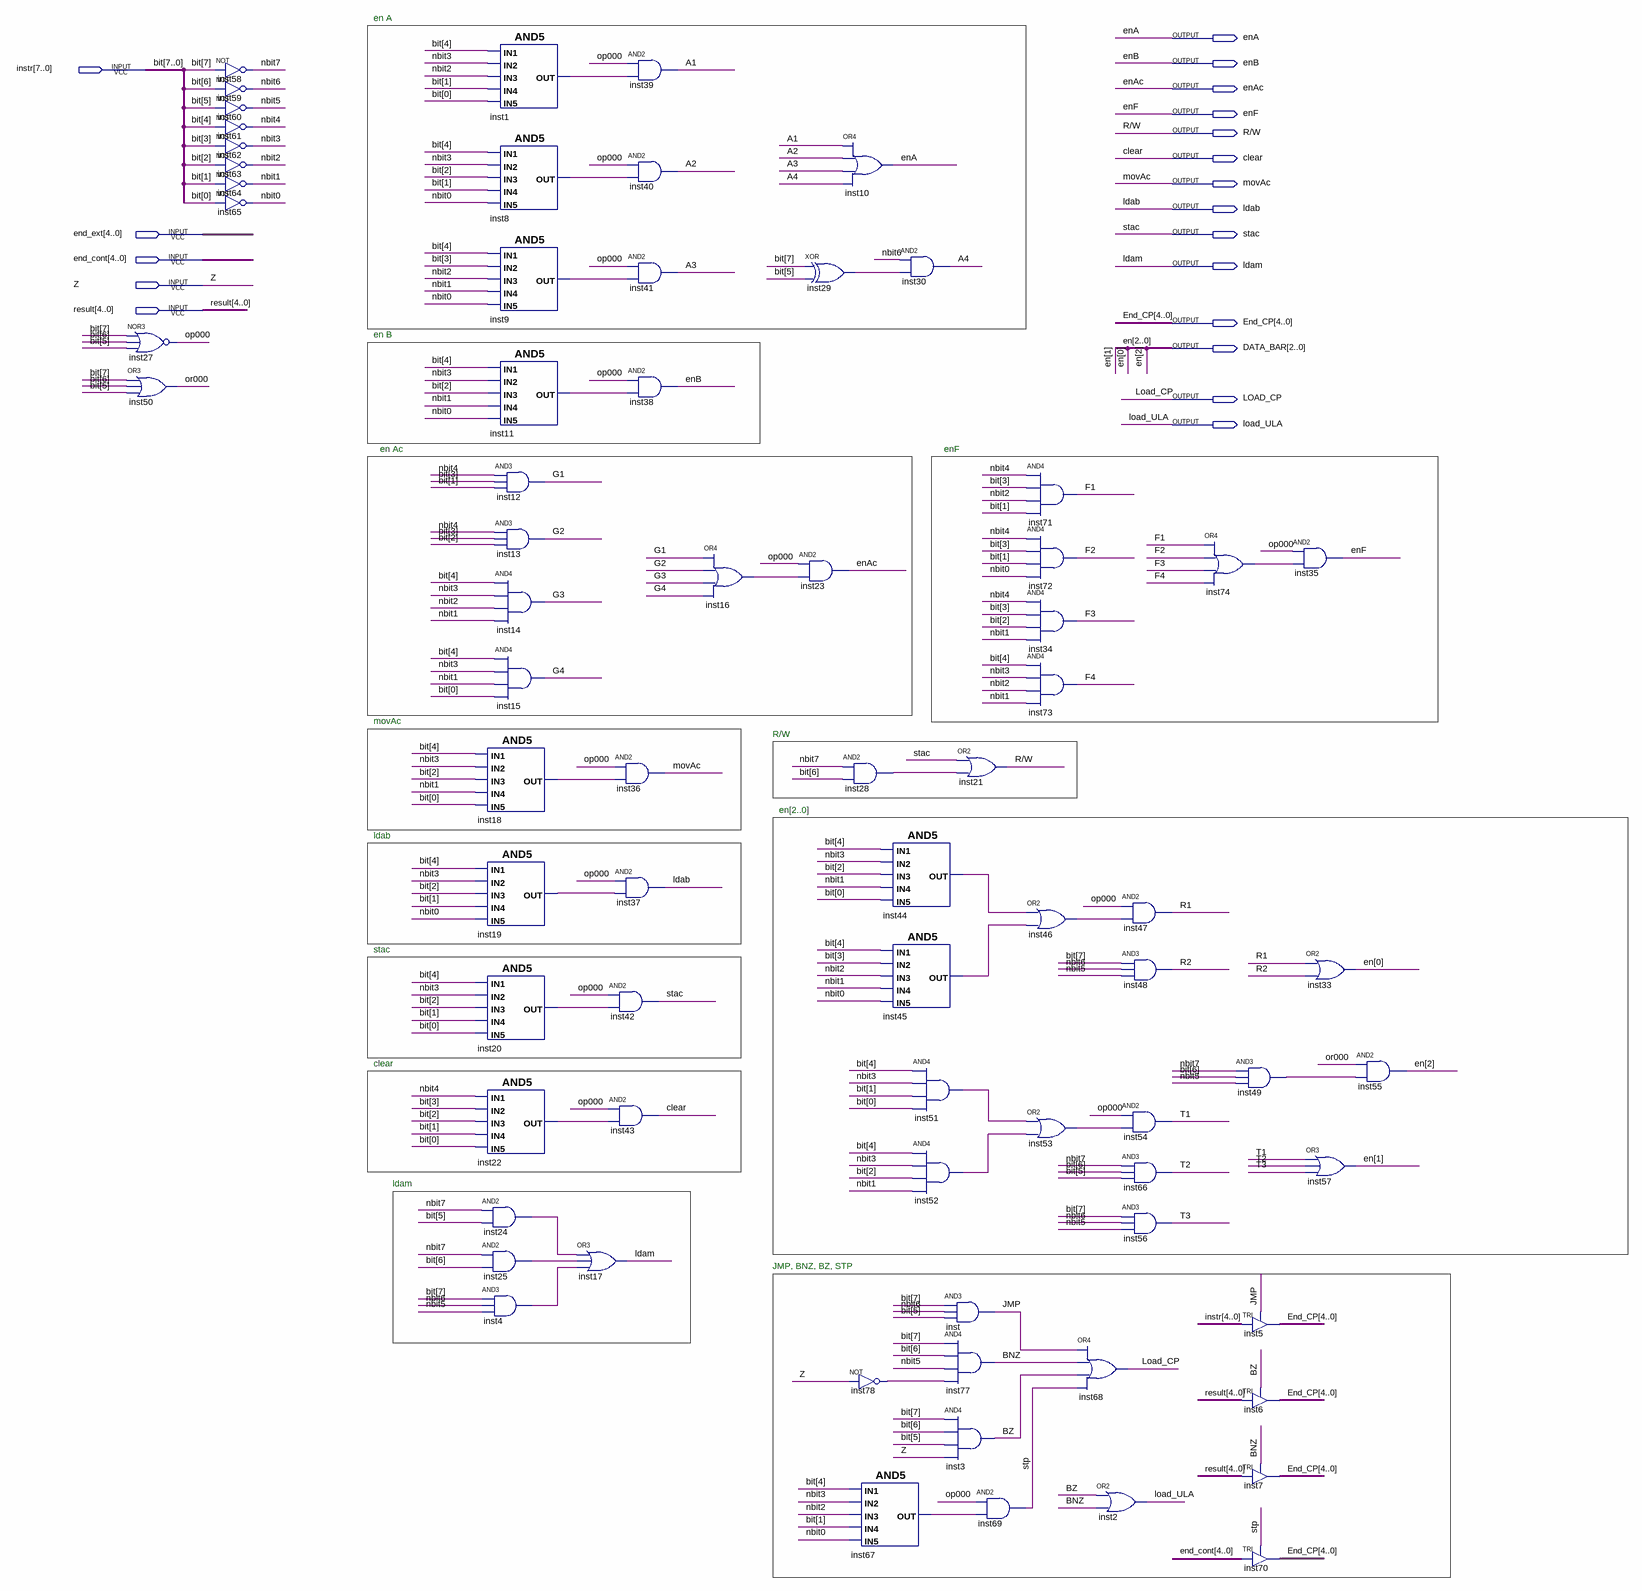
[diagram p0: schematic sheet]
// Quartus schematic decoderFinal.bdf as structural Verilog: 74 symbols, 19 pins
module decoderFinal (
  input  [7:0] instr,
  input  [4:0] end_ext,
  input  [4:0] end_cont,
  input  Z,
  input  [4:0] result,
  output enA,
  output enB,
  output enAc,
  output enF,
  output \R/W ,
  output clear,
  output movAc,
  output ldab,
  output stac,
  output ldam,
  output [4:0] End_CP,
  output [2:0] DATA_BAR,
  output LOAD_CP,
  output load_ULA
);

  wire A1, A2, A3, A4, BNZ, BZ, F1, F2, F3, F4, G1, G2, G3, G4, inst1_out, inst4_out, inst8_out, inst9_out,
       inst11_out, inst16_out, inst18_out, inst19_out, inst20_out, inst22_out, inst24_out, inst25_out,
       inst28_out, inst29_out, inst44_out, inst45_out, inst46_out, inst49_out, inst51_out, inst52_out,
       inst53_out, inst67_out, inst74_out, inst78_out, JMP, nbit0, nbit1, nbit2, nbit3, nbit4, nbit5, nbit6,
       nbit7, op000, or000, R1, R2, stp, T1, T2, T3;

  nor inst27 (op000, instr[7], instr[6], instr[5]);
  or inst50 (or000, instr[7], instr[6], instr[5]);
  not inst58 (nbit7, instr[7]);
  not inst59 (nbit6, instr[6]);
  not inst60 (nbit5, instr[5]);
  not inst61 (nbit4, instr[4]);
  not inst62 (nbit3, instr[3]);
  not inst63 (nbit2, instr[2]);
  not inst64 (nbit1, instr[1]);
  not inst65 (nbit0, instr[0]);
  and inst18 (inst18_out, instr[4], nbit3, instr[2], nbit1, instr[0]);
  and inst19 (inst19_out, instr[4], nbit3, instr[2], instr[1], nbit0);
  and inst20 (inst20_out, instr[4], nbit3, instr[2], instr[1], instr[0]);
  and inst22 (inst22_out, nbit4, instr[3], instr[2], instr[1], instr[0]);
  and inst24 (inst24_out, nbit7, instr[5]);
  and inst25 (inst25_out, nbit7, instr[6]);
  and inst4 (inst4_out, instr[7], nbit6, nbit5);
  and inst1 (inst1_out, instr[4], nbit3, nbit2, instr[1], instr[0]);
  and inst8 (inst8_out, instr[4], nbit3, instr[2], instr[1], nbit0);
  and inst9 (inst9_out, instr[4], instr[3], nbit2, nbit1, nbit0);
  and inst11 (inst11_out, instr[4], nbit3, instr[2], nbit1, nbit0);
  and inst12 (G1, nbit4, instr[3], instr[1]);
  and inst13 (G2, nbit4, instr[3], instr[2]);
  and inst14 (G3, instr[4], nbit3, nbit2, nbit1);
  and inst15 (G4, instr[4], nbit3, nbit1, instr[0]);
  or inst17 (ldam, inst24_out, inst25_out, inst4_out);
  and inst39 (A1, op000, inst1_out);
  and inst40 (A2, op000, inst8_out);
  and inst41 (A3, op000, inst9_out);
  and inst38 (enB, op000, inst11_out);
  and inst36 (movAc, op000, inst18_out);
  and inst37 (ldab, op000, inst19_out);
  and inst42 (stac, op000, inst20_out);
  and inst43 (clear, op000, inst22_out);
  or inst16 (inst16_out, G1, G2, G3, G4);
  xor inst29 (inst29_out, instr[7], instr[5]);
  and inst23 (enAc, op000, inst16_out);
  or inst10 (enA, A1, A2, A3, A4);
  and inst28 (inst28_out, nbit7, instr[6]);
  and inst44 (inst44_out, instr[4], nbit3, instr[2], nbit1, instr[0]);
  and inst45 (inst45_out, instr[4], instr[3], nbit2, nbit1, nbit0);
  not inst78 (inst78_out, Z);
  and inst67 (inst67_out, instr[4], nbit3, nbit2, instr[1], nbit0);
  and inst30 (A4, nbit6, inst29_out);
  and inst51 (inst51_out, instr[4], nbit3, instr[1], instr[0]);
  and inst52 (inst52_out, instr[4], nbit3, instr[2], nbit1);
  or inst21 (\R/W , stac, inst28_out);
  and inst (JMP, instr[7], nbit6, instr[5]);
  and inst77 (BNZ, instr[7], instr[6], nbit5, inst78_out);
  and inst3 (BZ, instr[7], instr[6], instr[5], Z);
  and inst69 (stp, op000, inst67_out);
  and inst71 (F1, nbit4, instr[3], nbit2, instr[1]);
  and inst72 (F2, nbit4, instr[3], instr[1], nbit0);
  and inst34 (F3, nbit4, instr[3], instr[2], nbit1);
  and inst73 (F4, instr[4], nbit3, nbit2, nbit1);
  or inst46 (inst46_out, inst44_out, inst45_out);
  or inst53 (inst53_out, inst51_out, inst52_out);
  or inst68 (LOAD_CP, JMP, BNZ, BZ, stp);
  and inst47 (R1, op000, inst46_out);
  and inst48 (R2, instr[7], nbit6, nbit5);
  and inst54 (T1, op000, inst53_out);
  and inst66 (T2, nbit7, instr[6], instr[5]);
  and inst56 (T3, instr[7], nbit6, nbit5);
  or inst2 (load_ULA, BZ, BNZ);
  or inst74 (inst74_out, F1, F2, F3, F4);
  and inst49 (inst49_out, nbit7, instr[6], nbit5);
  TRI inst5[4:0] (.IN(instr[4:0]), .OE(JMP), .OUT(End_CP));
  TRI inst6[4:0] (.IN(result), .OE(BZ), .OUT(End_CP));
  TRI inst7[4:0] (.IN(result), .OE(BNZ), .OUT(End_CP));
  TRI inst70[4:0] (.IN(end_cont), .OE(stp), .OUT(End_CP));
  and inst35 (enF, op000, inst74_out);
  or inst33 (DATA_BAR[0], R1, R2);
  or inst57 (DATA_BAR[1], T1, T2, T3);
  and inst55 (DATA_BAR[2], or000, inst49_out);

  // Other names for the same wires on the sheet: bit[7:0] = instr; en[2:0] = DATA_BAR

  // Notes on the sheet:
  //   en A
  //   en B
  //   en Ac
  //   enF
  //   movAc
  //   R/W
  //   en[2..0]
  //   ldab
  //   stac
  //   clear
  //   ldam
  //   JMP, BNZ, BZ, STP
endmodule
